# EAGLE design Business Card5x (EAGLE 6.4)
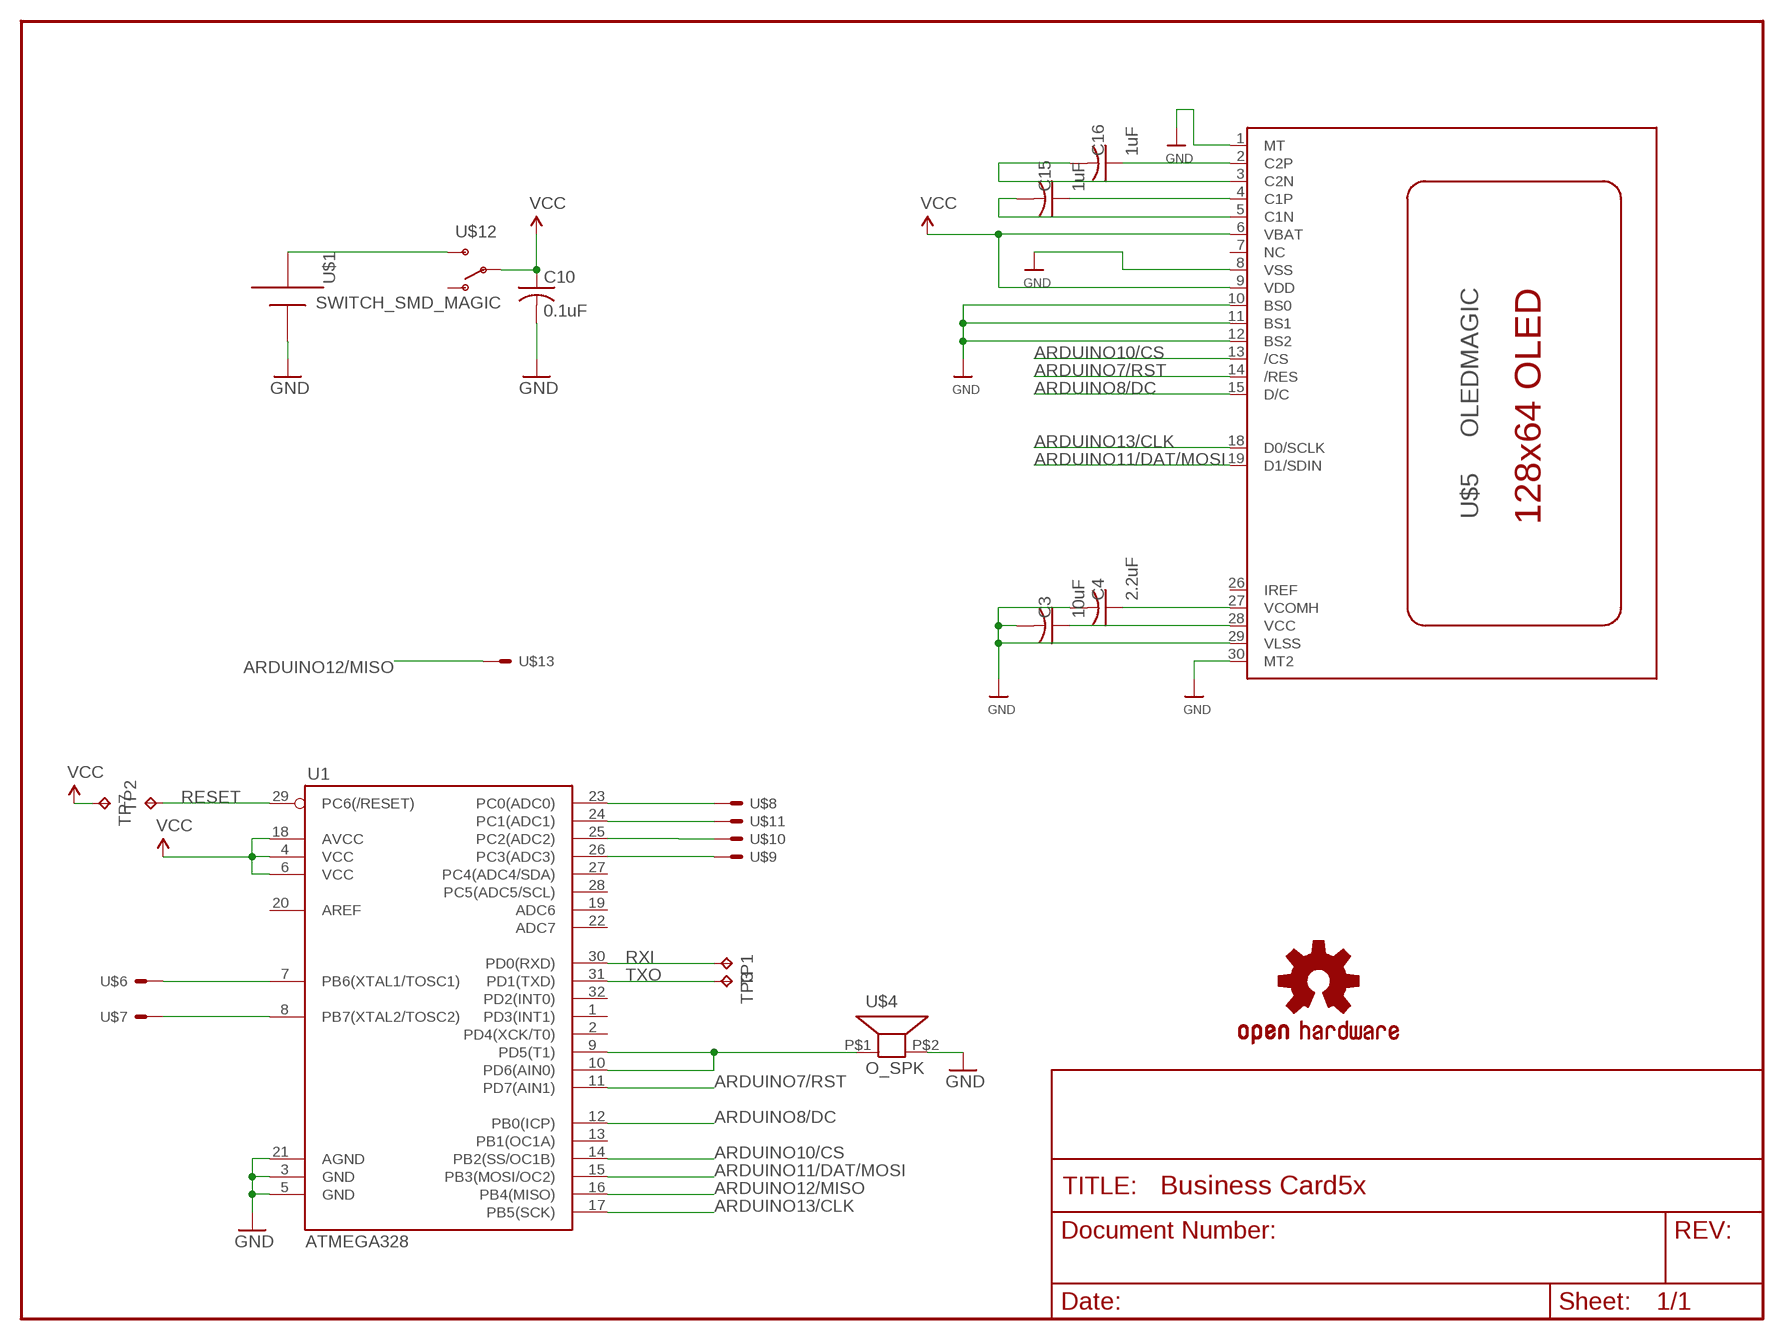
[diagram p0: schematic, sheet 1]

## Parts
C3  10uF  O_CAP0805  [1MILCIR]
C4  2.2uF  O_CAP0805  [1MILCIR]
C10  0.1uF  O_CAP0805  [1MILCIR]
C15  1uF  O_CAP0805  [1MILCIR]
C16  1uF  O_CAP0805  [1MILCIR]
TP1  TPTP14R  [TP14R]
TP2  TPTP14R  [TP14R]
TP3  TPTP14R  [TP14R]
TP7  TPTP08SQ  [TP08SQ]
U1  ATMEGA328  O_ATMEGA328_32  [TQFP32]
U$1  2016BAT  [CR2016]
U$3  OSHW-LOGOS  [OSHW-LOGO-S]
U$4  O_SPK  [O_SPK]
U$5  OLEDMAGIC  [1X30OLED]
U$6  CAP_BUTTON  [CAPBUTTON]
U$7  CAP_BUTTON  [CAPBUTTON]
U$8  CAP_DPAD  [DPAD]
U$9  CAP_DPAD  [DPAD]
U$10  CAP_DPAD  [DPAD]
U$11  CAP_DPAD  [DPAD]
U$12  SWITCH_SMD_MAGIC  [SWITCH_SMD_SUNKEN]
U$13  VERT_TEST  [VERT_TEST]

## Nets
3.3V: C10.P$1 TP7.TP U1.4(VCC) U1.6(VCC) U1.18(AVCC) U$5.6(VBAT) U$5.9(VDD) U$12.2(P) ; supply symbol labelled VCC
ARDUINO7/RST: U1.11(PD7(AIN1)) U$5.14(/RES)
ARDUINO8/DC: U1.12(PB0(ICP)) U$5.15(D/C)
ARDUINO10/CS: U1.14(PB2(SS/OC1B)) U$5.13(/CS)
ARDUINO11/DAT/MOSI: U1.15(PB3(MOSI/OC2)) U$5.19(D1/SDIN)
ARDUINO12/MISO: U1.16(PB4(MISO)) U$13.P$1(S)
ARDUINO13/CLK: U1.17(PB5(SCK)) U$5.18(D0/SCLK)
GND: C3.P$2 C4.P$2 C10.P$2 U1.3(GND) U1.5(GND) U1.21(AGND) U$1.P$1(+) U$4.P$2 U$5.1(MT) U$5.8(VSS) U$5.10(BS0) U$5.11(BS1) U$5.12(BS2) U$5.29(VLSS) U$5.30(MT2)
N$1: U1.23(PC0(ADC0)) U$8.P$1(S)
N$2: U1.24(PC1(ADC1)) U$11.P$1(S)
N$3: U1.25(PC2(ADC2)) U$10.P$1(S)
N$4: U1.26(PC3(ADC3)) U$9.P$1(S)
N$5: C16.P$1 U$5.2(C2P)
N$6: C16.P$2 U$5.3(C2N)
N$7: U1.9(PD5(T1)) U1.10(PD6(AIN0)) U$4.P$1
N$8: C15.P$1 U$5.4(C1P)
N$9: C15.P$2 U$5.5(C1N)
N$10: U1.7(PB6(XTAL1/TOSC1)) U$6.P$1(S) U$6.P$2(S)
N$11: C3.P$1 U$5.28(VCC)
N$12: C4.P$1 U$5.27(VCOMH)
N$13: U1.8(PB7(XTAL2/TOSC2)) U$7.P$1(S) U$7.P$2(S)
N$14: U$1.P$2(-) U$12.3(S)
RESET: TP2.TP U1.29(PC6(/RESET))
RXI: TP1.TP U1.30(PD0(RXD))
TXO: TP3.TP U1.31(PD1(TXD))
Unconnected: U1.1(PD3(INT1)) U1.2(PD4(XCK/T0)) U1.13(PB1(OC1A)) U1.19(ADC6) U1.20(AREF) U1.22(ADC7) U1.27(PC4(ADC4/SDA)) U1.28(PC5(ADC5/SCL)) U1.32(PD2(INT0)) U$5.7(NC) U$5.26(IREF) U$12.1(O)

## Library data of the parts
C3 C4 C10 C15 C16 = !klib:O_CAP0805
TP1-TP3 TP7 = testpad:TP: Test pad
U1 = !klib:O_ATMEGA328_32
U$1 = !klib:2016BAT
U$3 = SparkFun:OSHW-LOGO: Open Source Hardware Logo This logo indicates the piece of hardware it is found on incorporates a OSHW license and/or adheres to the definition of open source hardware found here: http://freedomdefined.org/OSHW
U$4 = !klib:O_SPK
U$5 = !klib:OLEDMAGIC
U$6 U$7 = !klib:CAP_BUTTON
U$8-U$11 = !klib:CAP_DPAD
U$12 = !klib:SWITCH_SMD_MAGIC
U$13 = !klib:VERT_TEST

## Net classes
1 vcc: width 0.254 mm

## Board
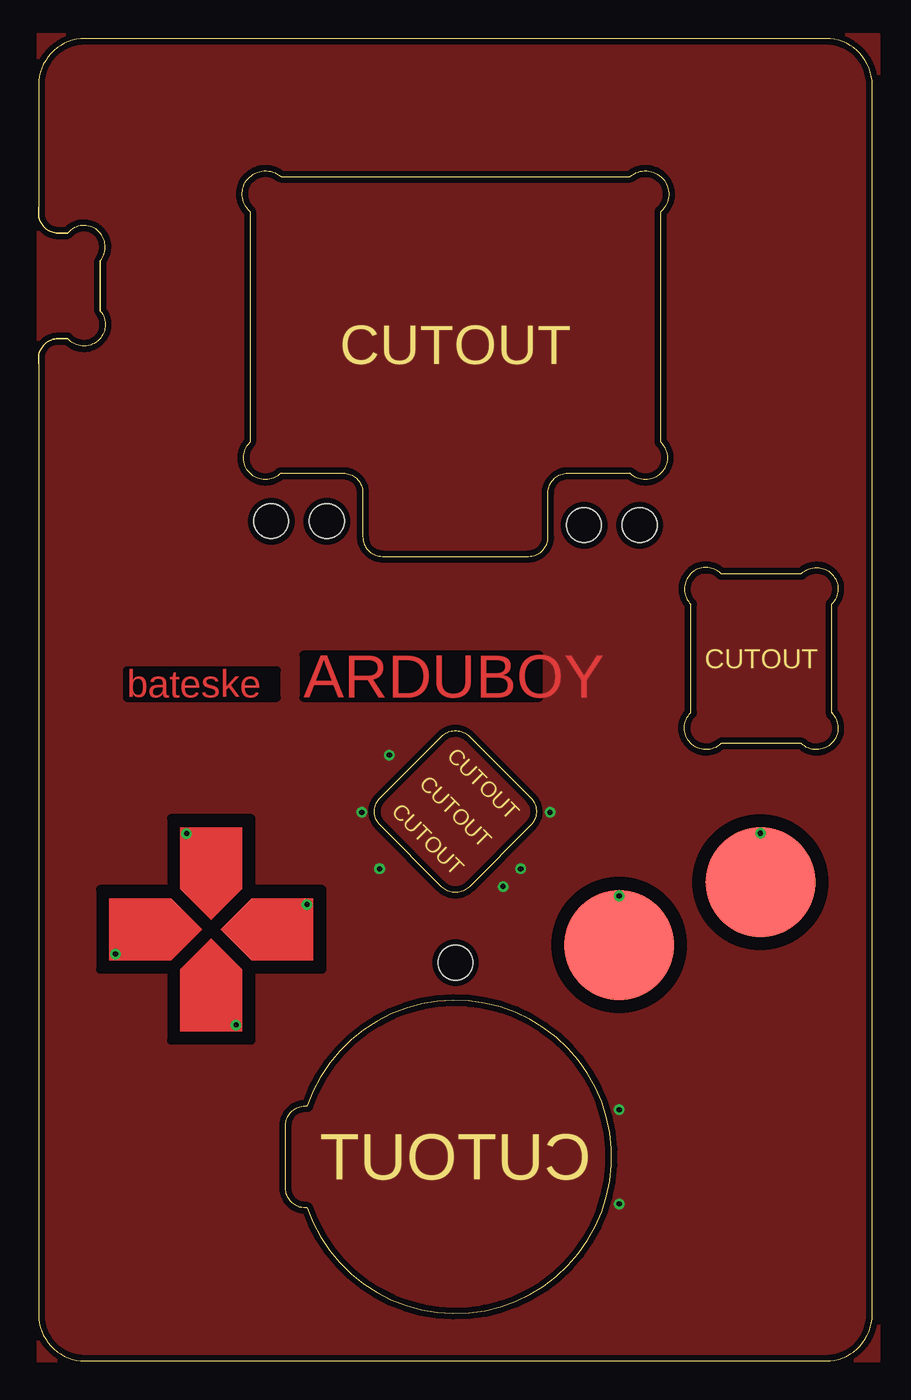
[diagram p1: board, top side]
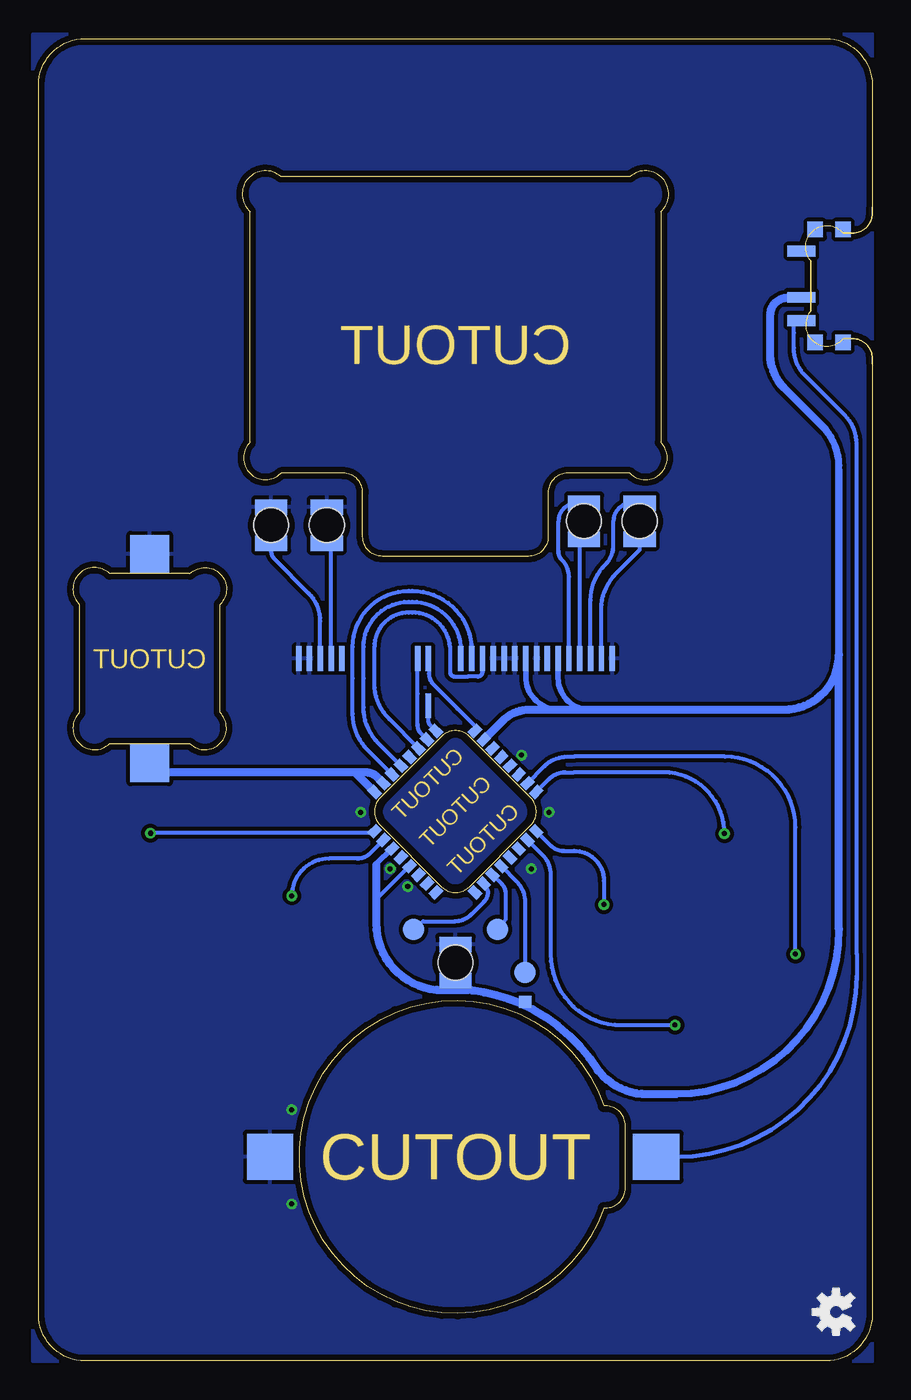
[diagram p2: board, bottom side, seen from below]

Size 53.98 x 85.6 mm. Coordinates in mm from the lower left corner, seen from the top.
Outline: 3,0 50.98,0 arc90 53.98,3 53.98,82.6 arc90 50.98,85.6 3,85.6 arc90 0,82.6 0,74.68 0,74.28 arc90 1.27,73.01 1.88,73.01 arc-180 3.99,71.22 3.99,67.97 arc-180 1.88,66.18 1.27,66.18 arc90 0,64.91 0,64.52 0,3 arc90 3,0
Copper layers (1*16): Top 0.0356mm / dielectric 1.5011mm / Bottom 0.0356mm
Design rules "LaenPCBOrder *": minimum track width 6mil, minimum drill 13mil, track to track 6mil, track to pad 6mil, pad to pad 6mil, via to via 6mil, smd to smd 6mil, copper to edge 15mil, drill to drill 6mil, minimum pad ring 7mil, minimum via ring 7mil, stop-mask expansion 4mil, vias tented up to drill 100mil, thermal gap 10mil

### Footprints (pad centres in the part's own frame; a part is rotated, then mirrored left to right if it is on the bottom)
1MILCIR = smd 2.08 x 1: P$1 0,-1.17; P$2 0,1.17 | hole 2.235: 0,0
TP14R = smd 1.4 x 1.4: TP 0,0
TP08SQ = smd 0.8 x 0.8: TP 0,0
TQFP32 = smd 0.8 x 0.559 bottom: 1 -4.593,2.8; 2 -4.593,2; 3 -4.593,1.2; 4 -4.593,0.4; 5 -4.593,-0.4; 6 -4.593,-1.2; 7 -4.593,-2; 8 -4.593,-2.8; 17 4.593,-2.8; 18 4.593,-2; 19 4.593,-1.2; 20 4.593,-0.4; 21 4.593,0.4; 22 4.593,1.2; 23 4.593,2; 24 4.593,2.8 | smd 0.559 x 0.8 bottom: 9 -2.8,-4.593; 10 -2,-4.593; 11 -1.2,-4.593; 12 -0.4,-4.593; 13 0.4,-4.593; 14 1.2,-4.593; 15 2,-4.593; 16 2.8,-4.593; 25 2.8,4.593; 26 2,4.593; 27 1.2,4.593; 28 0.4,4.593; 29 -0.4,4.593; 30 -1.2,4.593; 31 -2,4.593; 32 -2.8,4.593
CR2016 = smd 3 x 3: P$1 12,0; P$2 -13,0
O_SPK = smd 2.5 x 2.5 bottom: P$1 0,6.75; P$2 0,-6.75
1X30OLED = smd 0.35 x 1.6 bottom: 1 -10.15,0; 2 -9.45,0; 3 -8.75,0; 4 -8.05,0; 5 -7.35,0; 6 -6.65,0; 7 -5.95,0; 8 -5.25,0; 9 -4.55,0; 10 -3.85,0; 11 -3.15,0; 12 -2.45,0; 13 -1.75,0; 14 -1.05,0; 15 -0.35,0; 18 1.75,0; 19 2.45,0; 26 7.35,0; 27 8.05,0; 28 8.75,0; 29 9.45,0; 30 10.15,0
CAPBUTTON = smd 7.112 x 7.112: P$1 0,0 | drill 0.33 pad 0.686: P$2 0,3.175
DPAD = drill 0.33 pad 0.686: P$1 -6.2,-1.6
SWITCH_SMD_SUNKEN = smd 0.7 x 1.8: 1 -2.25,-4.592; 2 0.75,-4.592; 3 2.25,-4.592 | smd 1 x 1: GND1 -3.65,-1.892; GND2 -3.65,-3.692; GND3 3.65,-1.892; GND4 3.65,-3.692
VERT_TEST = smd 0.35 x 1.6: P$1 0,0

### Placement (x,y rotation side)
C3  38.92,54.1 0 bottom
C4  35.32,54.1 0 bottom
C10  26.99,25.78 0 bottom
C15  18.66,54.36 0 bottom
C16  15.06,54.36 0 bottom
TP1  24.26,27.94 0 bottom
TP2  22.48,25.15 0 bottom
TP3  29.72,27.94 0 bottom
TP7  22.48,23.24 0 bottom
U1  26.99,35.56 135 top
U$1  26.99,13.21 180 bottom
U$3  2.36,3.17 90 bottom
U$4  46.79,45.47 180 top
U$5  26.99,45.47 0 top
U$6  37.59,26.92 0 top
U$7  46.74,30.99 0 top
U$8  11.18,27.94 0 top
U$9  11.18,27.94 90 top
U$10  11.18,27.94 180 top
U$11  11.18,27.94 270 top
U$12  0,69.6 270 bottom
U$13  28.74,42.42 180 bottom

### Tracks (layer width: path | path; a pad name or v marks a point on that pad's centre or on a via)
3.3V
  Bottom 0.254: U1.4 32.03,29.96 arc-45 32.13,29.71
  Bottom 0.356: U$5.9 22.44,44.28 arc-90 20.32,42.16 | U$5.6 20.34,44.2 arc-90 18.31,42.16 17.27,42.16 | 32.13,32.08 arc108 32.14,32.17 U1.6
  Bottom 0.457: 2.16,57.66 arc-43 3.05,60.33
  Bottom 0.483: 12.7,17.27 arc-90 2.16,27.94 | 2.16,45.72 2.16,57.66 | 3.05,60.33 5.71,62.99
  Bottom 0.508: 12.7,17.27 14.57,17.27 arc45 17.45,18.46 17.78,18.8 arc-35 22.86,23.18 | 2.16,27.94 2.16,45.72 arc90 5.71,42.16 9.65,42.16 17.27,42.16 18.29,42.16 20.32,42.16 22.18,42.16 arc-45 23.94,41.44 U1.18 | 5.71,62.99 arc45 6.6,65.14 6.6,67.69 arc90 5.46,68.83 4.6,68.83 arc-90 U$12.2 | 22.86,23.18 arc-14 25.91,23.98 26.2,24.02 | 26.2,24.02 26.43,24.05 C10.P$1 | TP7.TP 22.86,23.18 | 32.13,32.08 32.13,29.46 | 32.13,29.46 32.13,28.96 32.13,28.32 arc-90 27.81,24 26.2,24 26.2,24.02 | 32.13,29.71 32.13,29.46
ARDUINO7/RST
  Bottom 0.152: U1.11 30.84,37.7
  Bottom 0.254: U$5.14 25.94,45.99 arc-90 29.79,49.84 30.03,49.84 arc-90 33.64,46.23 33.64,44.2 33.64,41.88 arc-45 32.67,39.55 U1.11
ARDUINO8/DC
  Bottom 0.254: 30.39,38.26 U1.12 31.97,39.98 arc45 32.94,42.31 32.94,44.2 32.94,46.22 arc90 30.02,49.14 29.79,49.14 arc90 26.64,45.99 U$5.15
ARDUINO10/CS
  Bottom 0.254: U$5.13 25.24,44.6 arc90 25.55,44.3 26.2,44.3 27.04,44.3 arc90 27.34,44.6 27.34,45.45 27.34,45.47 27.34,46.23 arc-80 29.55,48.44 29.79,48.44 30.03,48.44 arc-90 32.24,46.23 32.24,44.2 32.24,43.88 arc-45 31.27,41.54 U1.14 29.23,39.39
ARDUINO11/DAT/MOSI
  Bottom 0.254: U$5.19 29.44,43.18 29.44,41.21 29.44,41.15 arc-45 29.22,40.62 U1.15
ARDUINO12/MISO
  Bottom 0.254: U$13.P$1 28.74,41.43 arc-45 28.63,41.16 U1.16
ARDUINO13/CLK
  Bottom 0.152: U$5.18 28.74,45.25
  Bottom 0.254: U1.17 arc-45 25.71,41.08 26.86,42.23 | 28.74,45.28 U$5.18 arc90 28.7,45.43 28.7,44.96 28.7,44.49 arc-45 28.4,43.77 26.86,42.23 | 26.86,42.23
GND  (via drill 0.33 pad 0.18)
  other vias: 31.22,31.85 30.07,30.71 22.71,39.22 20.93,35.51 33.12,35.51 22.07,31.85 37.59,10.16 37.59,16.26
  pour Top (isolate 0.254): 54.36,0 0,0 0,85.85 54.36,85.85
  pour Bottom (isolate 0.254): 0,85.85 54.36,85.85 54.36,0 0,0
N$1
  Bottom 0.254: U$8.P$1 4.97,34.54 arc-90 9.54,39.12 19.3,39.12 19.74,39.12 arc-45 21.22,38.51 U1.23
N$2
  Bottom 0.254: U$11.P$1 arc-90 13.5,38.1 19.3,38.1 19.88,38.1 arc-45 20.92,37.67 U1.24
N$3
  Bottom 0.254: U$10.P$1 17.38,31.1 arc-90 19.3,33.02 19.98,33.02 arc45 20.85,33.38 U1.25
N$4
  Bottom 0.254: U$9.P$1 16.26,21.74 arc90 20.83,26.31 20.83,30.99 20.83,31.47 arc-45 21.36,32.76 U1.26
N$5
  Bottom 0.254: C16.P$1 15.06,52.5 16.57,50.99 arc-45 17.54,48.66 U$5.2
N$6
  Bottom 0.254: C16.P$2 15.59,55.53 arc-90 16.76,54.36 16.76,52.79 arc45 17.27,51.56 arc-45 18.24,49.23 U$5.3
N$7
  Bottom 0.254: 45.72,38.1 46.66,39.04 U$4.P$1
  Bottom 0.508: 45.72,38.1 34.17,38.1 33.53,38.1 | U1.9 33.49,38.1 33.53,38.1 | U1.10 32.02,37.77 arc-45 32.83,38.1 33.53,38.1
N$8
  Bottom 0.254: U$5.4 18.94,52.91 C15.P$1
N$9
  Bottom 0.254: C15.P$2 19.15,55.53 arc-90 20.32,54.36 20.32,52.4 arc-45 20.09,51.84 arc45 19.64,50.76 U$5.5
N$10
  Top 0.254: U$6.P$2 U$6.P$1
  Bottom 0.254: U$6.P$2 arc90 35.18,32.51 33.34,32.51 arc-45 32.53,32.85 U1.7
N$11
  Bottom 0.254: C3.P$1 38.92,52.44 arc-45 38.69,51.9 36.48,49.69 arc45 35.74,47.9 U$5.28
N$12
  Bottom 0.254: U$5.27 35.04,52.66 C4.P$1
N$13
  Top 0.254: U$7.P$1 U$7.P$2
  Bottom 0.254: U1.8 32.3,34.16 U$7.P$2
N$14
  Bottom 0.254: U$12.3 4.86,67.35 5.08,67.56 5.08,66.55 5.08,65.57 arc-45 4.34,63.77 1.76,61.2 arc45 1.02,59.4 1.02,26.37 1.02,24.89 | 12.7,13.21 U$1.P$2
  Bottom 0.305: 1.02,24.89 arc90 12.7,13.21
RESET
  Bottom 0.254: TP2.TP 22.48,26.45 22.48,29.68 arc-45 23.04,31.05 U1.29
RXI
  Bottom 0.254: TP1.TP 23.74,28.58 23.74,30.25 arc-45 23.99,30.87 U1.30
TXO
  Bottom 0.254: 25.17,31.01 U1.31 25.03,30.69 arc45 24.89,30.35 24.89,30.34 arc45 25.15,29.71 25.96,28.91 arc45 27.03,28.46 29.07,28.46 29.08,28.45 TP3.TP

### Text on the board
Top: bateske | ARDUBOY
tStop: bateske | ARDUBOY